# Altium project Robot Controller.PrjPCB
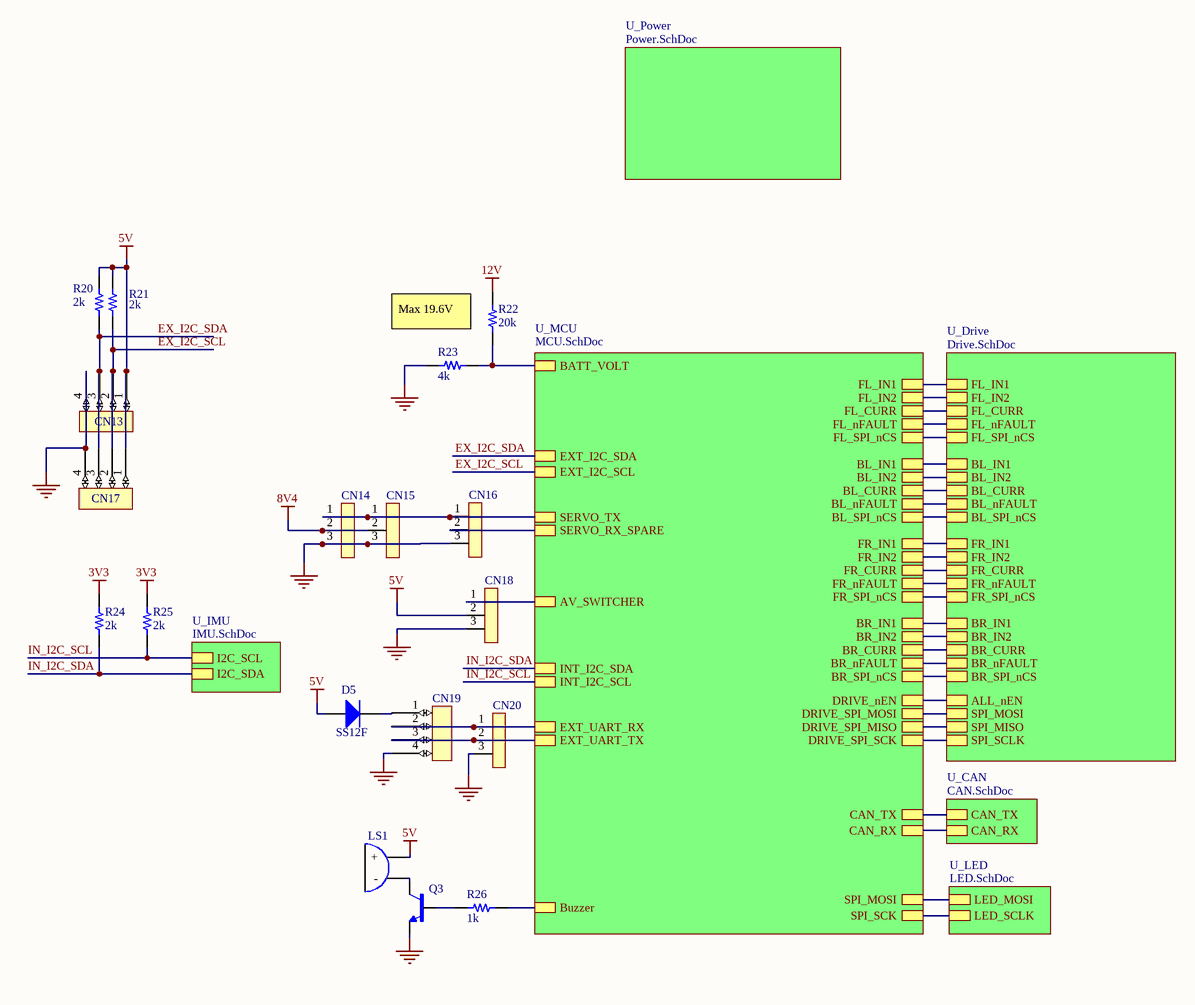
[diagram p0: Controller.SchDoc]
4 sheets, 90 parts. Net scope: hierarchical (ports join the sheet entries above them; power ports are global).
Board file: Controller.PcbDoc
Sheets:
  Controller.SchDoc
    U_MCU = MCU.SchDoc
    U_LED = LED.SchDoc
  DRV8843.SchDoc

## Sheet Controller.SchDoc
size A3

### Parts
CN13  JST_GH-4P  [JST_GH-4P]  (value not drawn)
CN14  3P-2.5mm  [2.5mm-3P]  (value not drawn)
CN15  3P-2.5mm  [2.5mm-3P]  (value not drawn)
CN16  3P-2.5mm  [2.5mm-3P]  (value not drawn)
CN17  JST_GH-4P  [JST_GH-4P]  (value not drawn)
CN18  3P-2.5mm  [2.5mm-3P]  (value not drawn)
CN19  JST_GH-4P  [JST_GH-4P]  (value not drawn)
CN20  3P-2.5mm  [2.5mm-3P]  (value not drawn)
D5  SS12F  [SMAF_DIODE]
LS1  Buzzer  [12-dia-buzzer]  (value not drawn)
Q3  S8050  [SOT23-FET]  (value not drawn)
R20  2k  [2010_SMD_Resistor]
R21  2k  [2010_SMD_Resistor]
R22  20k  [0805 - duplicate]
R23  4k  [0805 - duplicate]
R24  2k  [0805 - duplicate]
R25  2k  [0805 - duplicate]
R26  1k  [0805 - duplicate]

### Sub-sheets
U_CAN = CAN.SchDoc (file not in this document): CAN_TX, CAN_RX
U_Drive = Drive.SchDoc (file not in this document): FL_IN1, FL_IN2, ALL_nEN, BL_IN1, BL_IN2, FR_IN1, FR_IN2, BR_IN1, BR_IN2, FL_nFAULT, BL_nFAULT, BR_nFAULT, FR_nFAULT, FL_SPI_nCS, BL_SPI_nCS, BR_SPI_nCS, FR_SPI_nCS, SPI_MOSI, SPI_MISO, SPI_SCLK, BL_CURR, BR_CURR, FL_CURR, FR_CURR
U_IMU = IMU.SchDoc (file not in this document): I2C_SCL, I2C_SDA
U_LED = LED.SchDoc: LED_MOSI, LED_SCLK
U_MCU = MCU.SchDoc: BR_SPI_nCS, FR_SPI_nCS, BL_SPI_nCS, FL_SPI_nCS, FL_nFAULT, BL_nFAULT, FR_nFAULT, BR_nFAULT, BL_IN2, DRIVE_nEN, DRIVE_SPI_SCK, DRIVE_SPI_MISO, FR_IN2, SERVO_TX, SERVO_RX_SPARE, BL_CURR, FL_CURR, BATT_VOLT, BR_CURR, FR_CURR, FL_IN1, FL_IN2, BL_IN1, SPI_MOSI, SPI_SCK, FR_IN1, BR_IN1, BR_IN2, EXT_I2C_SCL, EXT_I2C_SDA, CAN_TX, CAN_RX, INT_I2C_SDA, INT_I2C_SCL, DRIVE_SPI_MOSI, EXT_UART_RX, EXT_UART_TX, AV_SWITCHER, Buzzer
U_Power = Power.SchDoc (file not in this document): no entries

### Nets
3V3: R24.2 R25.2
5V: CN13.1 CN17.1 CN18.2 D5.1(A) LS1.A(+) R20.2 R21.2
8V4: CN14.2 CN15.2
12V: R22.2
GND: CN13.4 CN14.3 CN15.3 CN16.3 CN17.4 CN18.3 CN19.4 CN20.3 Q3.2(E) R23.2
EX_I2C_SCL: CN13.2 CN17.2 R21.1 ; sheet U_MCU/EXT_I2C_SCL
EX_I2C_SDA: CN13.3 CN17.3 R20.1 ; sheet U_MCU/EXT_I2C_SDA
IN_I2C_SCL: R25.1 ; sheet U_IMU/I2C_SCL, sheet U_MCU/INT_I2C_SCL
IN_I2C_SDA: R24.1 ; sheet U_IMU/I2C_SDA, sheet U_MCU/INT_I2C_SDA
SWO: CN19.3 CN20.2 ; sheet U_MCU/EXT_UART_TX
NetCN14_1: CN14.1 CN15.1 CN16.1 ; sheet U_MCU/SERVO_TX
NetCN16_2: CN16.2 ; sheet U_MCU/SERVO_RX_SPARE
NetCN18_1: CN18.1 ; sheet U_MCU/AV_SWITCHER
NetCN19_1: CN19.1 D5.2(K)
NetCN19_2: CN19.2 CN20.1 ; sheet U_MCU/EXT_UART_RX
NetLS1_K: LS1.K(-) Q3.3(C)
NetQ3_1: Q3.1(B) R26.1
NetR22_1: R22.1 R23.1 ; sheet U_MCU/BATT_VOLT
NetR26_2: R26.2 ; sheet U_MCU/Buzzer
NetU3_2: sheet U_MCU/BR_SPI_nCS, sheet U_Drive/BR_SPI_nCS
NetU3_3: sheet U_MCU/FR_SPI_nCS, sheet U_Drive/FR_SPI_nCS
NetU3_4: sheet U_MCU/BL_SPI_nCS, sheet U_Drive/BL_SPI_nCS
NetU3_6: sheet U_MCU/FL_SPI_nCS, sheet U_Drive/FL_SPI_nCS
NetU3_8: sheet U_MCU/FL_nFAULT, sheet U_Drive/FL_nFAULT
NetU3_9: sheet U_MCU/BL_nFAULT, sheet U_Drive/BL_nFAULT
NetU3_10: sheet U_MCU/FR_nFAULT, sheet U_Drive/FR_nFAULT
NetU3_11: sheet U_MCU/BR_nFAULT, sheet U_Drive/BR_nFAULT
NetU3_14: sheet U_MCU/FL_IN1, sheet U_Drive/FL_IN1
NetU3_15: sheet U_MCU/FL_IN2, sheet U_Drive/FL_IN2
NetU3_16: sheet U_MCU/BL_IN1, sheet U_Drive/BL_IN1
NetU3_18: sheet U_MCU/BL_IN2, sheet U_Drive/BL_IN2
NetU3_20: sheet U_MCU/DRIVE_nEN, sheet U_Drive/ALL_nEN
NetU3_21: sheet U_MCU/DRIVE_SPI_SCK, sheet U_Drive/SPI_SCLK
NetU3_22: sheet U_MCU/DRIVE_SPI_MISO, sheet U_Drive/SPI_MISO
NetU3_23: sheet U_MCU/FR_IN2, sheet U_Drive/FR_IN2
NetU3_26: sheet U_MCU/BL_CURR, sheet U_Drive/BL_CURR
NetU3_27: sheet U_MCU/FL_CURR, sheet U_Drive/FL_CURR
NetU3_29: sheet U_MCU/BR_CURR, sheet U_Drive/BR_CURR
NetU3_30: sheet U_MCU/FR_CURR, sheet U_Drive/FR_CURR
NetU3_35: sheet U_MCU/SPI_MOSI, sheet U_LED/LED_MOSI
NetU3_36: sheet U_MCU/SPI_SCK, sheet U_LED/LED_SCLK
NetU3_37: sheet U_MCU/FR_IN1, sheet U_Drive/FR_IN1
NetU3_39: sheet U_MCU/BR_IN1, sheet U_Drive/BR_IN1
NetU3_40: sheet U_MCU/BR_IN2, sheet U_Drive/BR_IN2
NetU3_57: sheet U_MCU/DRIVE_SPI_MOSI, sheet U_Drive/SPI_MOSI
NetU3_61: sheet U_MCU/CAN_RX, sheet U_CAN/CAN_RX
NetU3_62: sheet U_MCU/CAN_TX, sheet U_CAN/CAN_TX

### Notes on the sheet
- (near R22) Max 19.6V

### Library data of the parts
Q3 = S8050: MF: MICROSS/On Semiconductor; MP: 2N2222; Value: *; Package: TO-18-3 NJS; Digi-Key_Purchase_URL: https://www.digikey.com.mx/product-detail/en/microsemi-corporation/JANS2N2222A/1086-15156-ND/4384334?utm_source=snapeda&utm_medium=aggregator&utm_campaign=symbol; SnapEDA_Link: https://www.snapeda.com/parts/2N2222/MICROSS/On%20Semiconductor/view-part/561967/?ref=snap; Digi-Key_Part_Number: 1086-15156-ND
R20-R26 = Resistor

## Sheet MCU.SchDoc
size A3
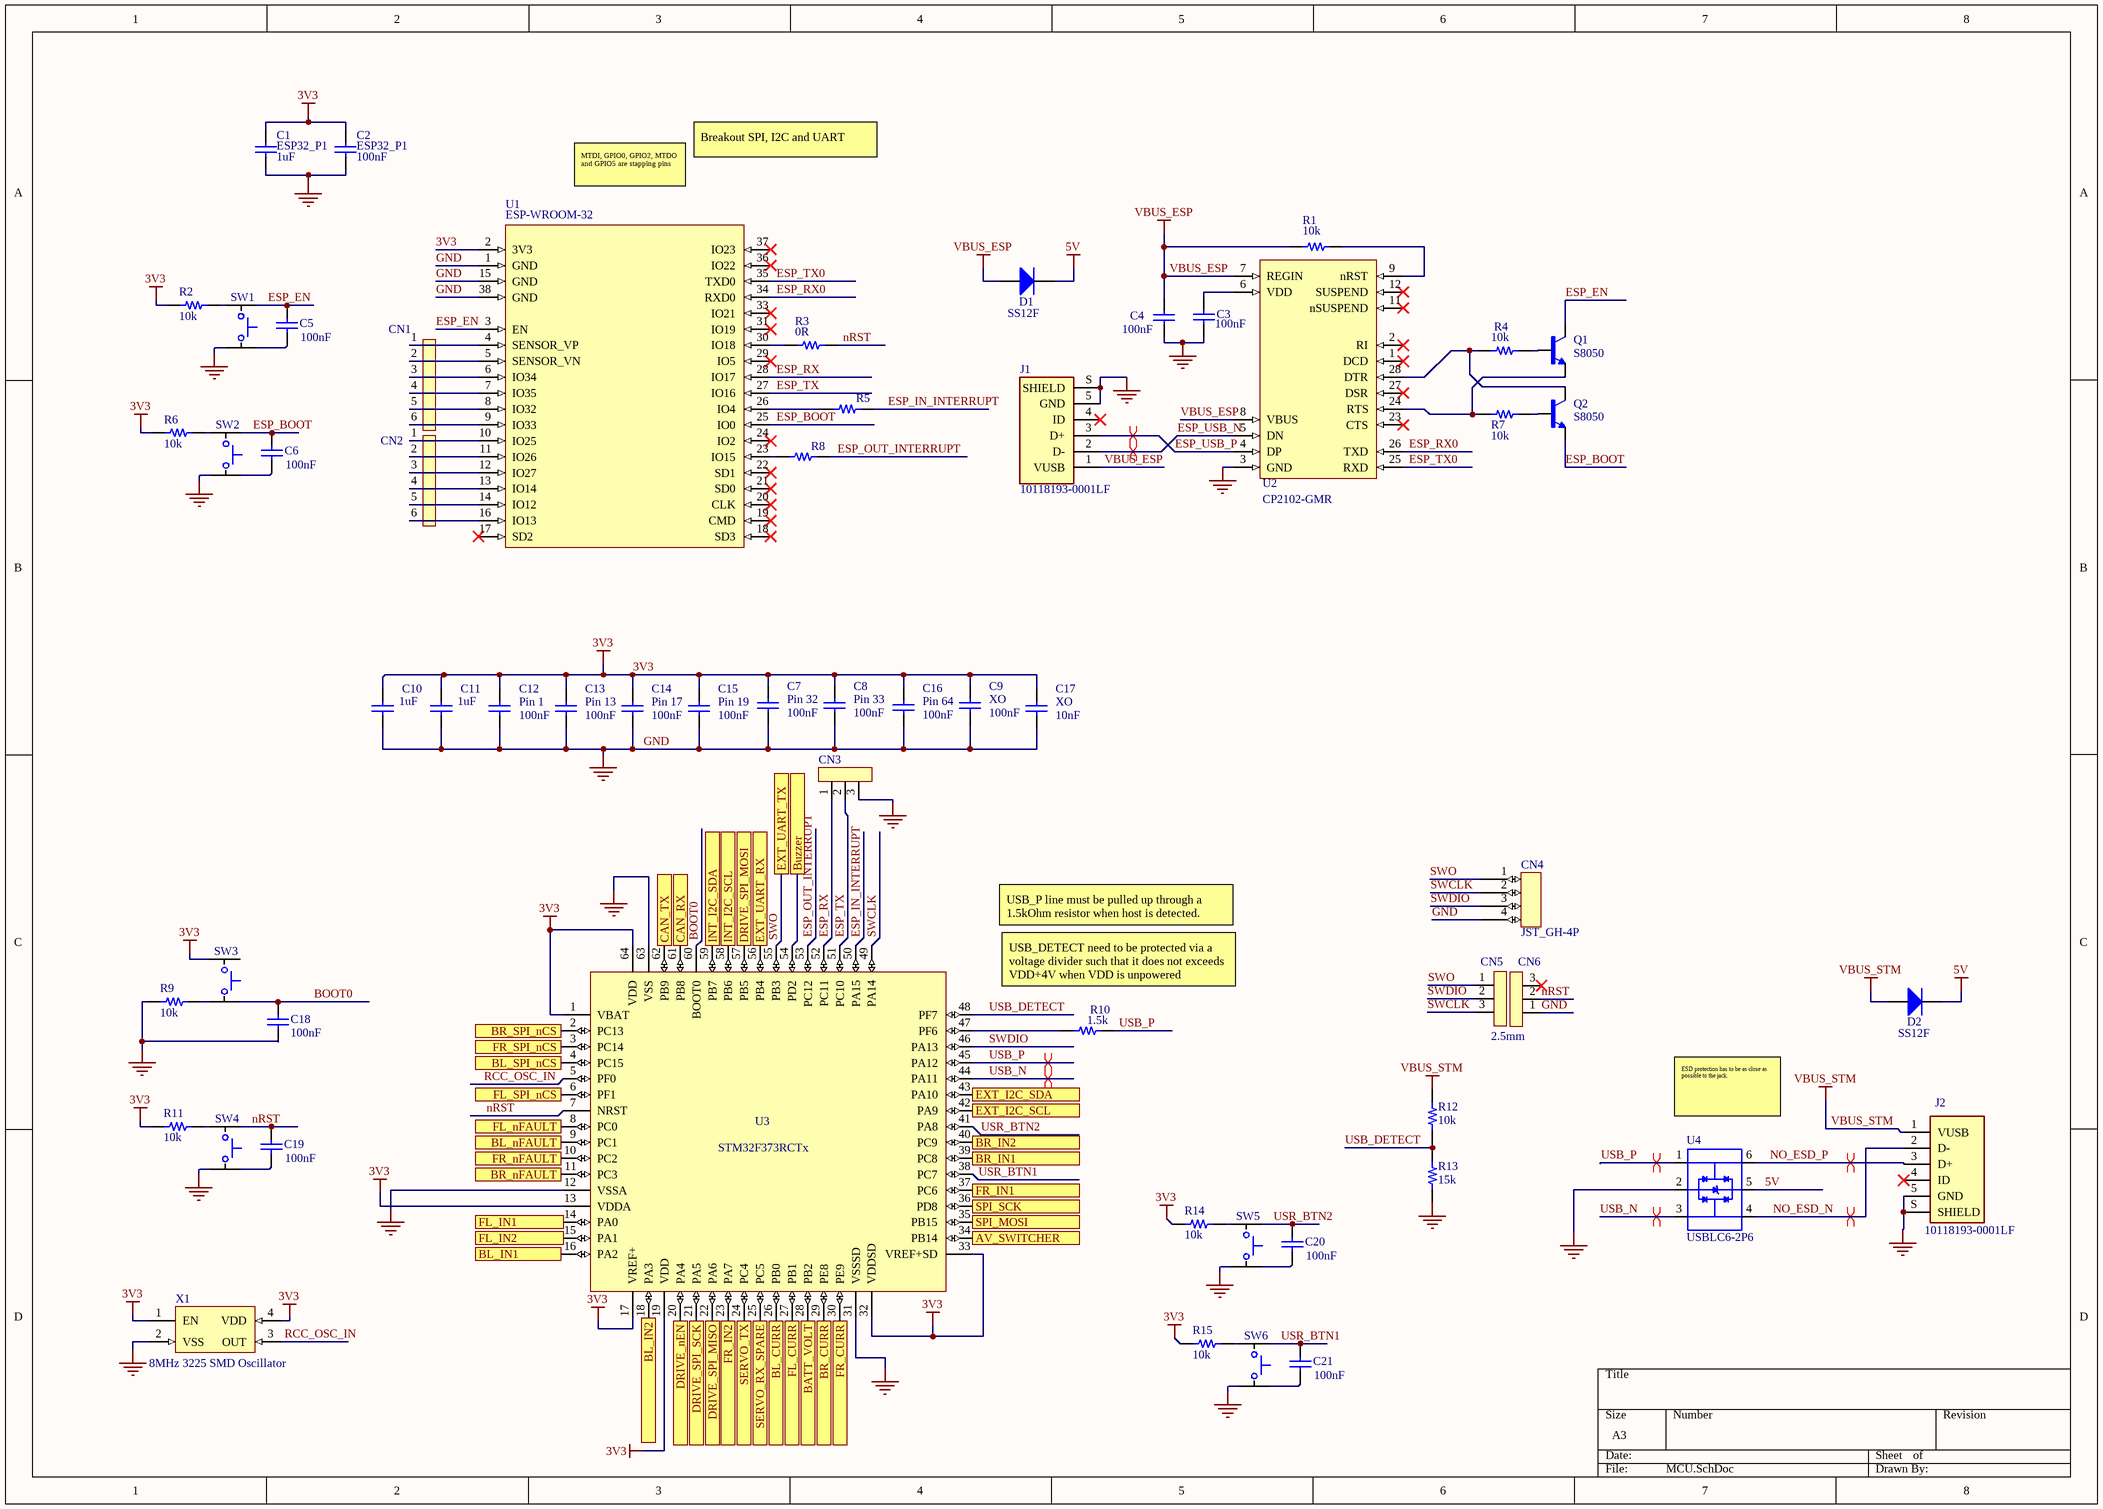
[diagram p1: MCU.SchDoc]

### Parts
C1  ESP32_P1  value 1uF  [0402]
C2  ESP32_P1  value 100nF  [0402]
C3  value 100nF  [0402]  (hidden comment: P6)
C4  value 100nF  [0402]  (hidden comment: P7)
C5  value 100nF  [0402]  (hidden comment: Cap)
C6  value 100nF  [0402]  (hidden comment: Cap)
C7  Pin 32  value 100nF  [0402]
C8  Pin 33  value 100nF  [0402]
C9  XO  value 100nF  [0402]
C10  value 1uF  [0402]
C11  value 1uF  [0402]
C12  Pin 1  value 100nF  [0402]
C13  Pin 13  value 100nF  [0402]
C14  Pin 17  value 100nF  [0402]
C15  Pin 19  value 100nF  [0402]
C16  Pin 64  value 100nF  [0402]
C17  XO  value 10nF  [0402]
C18  value 100nF  [0402]  (hidden comment: Cap)
C19  value 100nF  [0402]  (hidden comment: Cap)
C20  value 100nF  [0402]  (hidden comment: Cap)
C21  value 100nF  [0402]  (hidden comment: Cap)
CN1  6P-2.5mm  [6-Pin-Header]  (value not drawn)
CN2  6P-2.5mm  [6-Pin-Header]  (value not drawn)
CN3  3P-2.5mm  [2.5mm-3P]  (value not drawn)
CN4  JST_GH-4P  [JST_GH-4P]
CN5  2.5mm  [2.5mm-3P]
CN6  3P-2.5mm  [2.5mm-3P]  (value not drawn)
D1  SS12F  [SMAF_DIODE]
D2  SS12F  [SMAF_DIODE]
J1  10118193-0001LF  [FCI_10118193-0001LF]
J2  10118193-0001LF  [FCI_10118193-0001LF]
Q1  S8050  [SOT23-FET]
Q2  S8050  [SOT23-FET]
R1  10k  [0805 - duplicate]
R2  10k  [0805 - duplicate]
R3  0R  [0805 - duplicate]
R4  10k  [0805 - duplicate]
R5  1k  [0805 - duplicate]  (value not drawn)
R6  10k  [0805 - duplicate]
R7  10k  [0805 - duplicate]
R8  1k  [0805 - duplicate]  (value not drawn)
R9  10k  [0805 - duplicate]
R10  1.5k  [0805 - duplicate]
R11  10k  [0805 - duplicate]
R12  10k  [2010_SMD_Resistor]
R13  15k  [2010_SMD_Resistor]
R14  10k  [0805 - duplicate]
R15  10k  [0805 - duplicate]
SW1  SPST Switch  [4.8x4.8-SMD-SWITCH]  (value not drawn)
SW2  SPST Switch  [4.8x4.8-SMD-SWITCH]  (value not drawn)
SW3  SPST Switch  [4.8x4.8-SMD-SWITCH]  (value not drawn)
SW4  SPST Switch  [4.8x4.8-SMD-SWITCH]  (value not drawn)
SW5  USR_BTN2  [4.8x4.8-SMD-SWITCH]  (value not drawn)
SW6  USR_BTN1  [4.8x4.8-SMD-SWITCH]  (value not drawn)
U1  ESP-WROOM-32  [ESP-WROOM-32]
U2  CP2102-GMR  [QFN28G_0.5-5X5MM]
U3  STM32F373RCTx  [LQFP64]
U4  USBLC6-2P6  [SOT50P160X60-6N]
X1  8MHz 3225 SMD Oscillator  [3.2x2.5 SMD]

### Ports
AV_SWITCHER, BATT_VOLT, BL_CURR, BL_IN1, BL_IN2, BL_nFAULT, BL_SPI_nCS, BR_CURR, BR_IN1, BR_IN2, BR_nFAULT, BR_SPI_nCS, Buzzer, CAN_RX, CAN_TX, DRIVE_nEN, DRIVE_SPI_MISO, DRIVE_SPI_MOSI, DRIVE_SPI_SCK, EXT_I2C_SCL, EXT_I2C_SDA, EXT_UART_RX, EXT_UART_TX, FL_CURR, FL_IN1, FL_IN2, FL_nFAULT, FL_SPI_nCS, FR_CURR, FR_IN1, FR_IN2, FR_nFAULT, FR_SPI_nCS, INT_I2C_SCL, INT_I2C_SDA, SERVO_RX_SPARE, SERVO_TX, SPI_MOSI, SPI_SCK

### Nets
3V3: C1.2 C2.2 C7.2 C8.2 C9.2 C10.2 C11.2 C12.2 C13.2 C14.2 C15.2 C16.2 C17.2 R2.1 R6.1 R11.1 R14.1 R15.1 SW3.1 U1.2(3V3) U3.1(VBAT) U3.13(VDDA) U3.17(VREF+) U3.19(VDD) U3.32(VDDSD) U3.33(VREF+SD) U3.64(VDD) X1.1(EN) X1.4(VDD)
5V: D1.2(K) D2.2(K) U4.5(VBUS)
GND: C1.1 C2.1 C3.1 C4.1 C7.1 C8.1 C9.1 C10.1 C11.1 C12.1 C13.1 C14.1 C15.1 C16.1 C17.1 C18.2 CN3.3 CN4.4 CN6.1 J1.5(GND) J1.S(SHIELD) J2.5(GND) J2.S(SHIELD) R9.1 R13.1 SW1.3 SW2.3 SW4.3 SW5.3 SW6.3 U1.1(GND) U1.15(GND) U1.38(GND) U2.3(GND) U3.12(VSSA) U3.31(VSSSD) U3.63(VSS) U4.2(GND) X1.2(VSS)
VBUS_ESP: C4.2 D1.1(A) J1.1(VUSB) R1.1 U2.7(REGIN) U2.8(VBUS)
VBUS_STM: D2.1(A) J2.1(VUSB) R12.2
BOOT0: C18.1 SW3.4 U3.60(BOOT0)
ESP_BOOT: C6.2 Q2.2(E) SW2.2 U1.25(IO0)
ESP_EN: C5.2 Q1.3(C) SW1.2 U1.3(EN)
ESP_IN_INTERRUPT: R5.2 U3.50(PA15)
ESP_OUT_INTERRUPT: R8.2 U3.53(PC12)
ESP_RX: CN3.1 U1.28(IO17) U3.52(PC11)
ESP_RX0: U1.34(RXD0) U2.26(TXD)
ESP_TX: CN3.2 U1.27(IO16) U3.51(PC10)
ESP_TX0: U1.35(TXD0) U2.25(RXD)
ESP_USB_N: J1.2(D-) U2.5(DN)
ESP_USB_P: J1.3(D+) U2.4(DP)
EX_I2C_SCL: U3.42(PA9) ; port EXT_I2C_SCL
EX_I2C_SDA: U3.43(PA10) ; port EXT_I2C_SDA
IN_I2C_SCL: U3.58(PB6) ; port INT_I2C_SCL
IN_I2C_SDA: U3.59(PB7) ; port INT_I2C_SDA
NO_ESD_N: J2.2(D-) U4.4(I/O2_2)
NO_ESD_P: J2.3(D+) U4.6(I/O1_2)
nRST: C19.2 CN6.2 R3.2 SW4.2 U3.7(NRST)
RCC_OSC_IN: U3.5(PF0) X1.3(OUT)
SWCLK: CN4.2 CN5.3 U3.49(PA14)
SWDIO: CN4.3 CN5.2 U3.46(PA13)
SWO: CN4.1 CN5.1 U3.55(PB3) ; port EXT_UART_TX
USB_DETECT: R12.1 R13.2 U3.48(PF7)
USB_N: U3.44(PA11) U4.3(I/O2_1)
USB_P: R10.2 U3.45(PA12) U4.1(I/O1_1)
USR_BTN1: C21.2 SW6.2 U3.38(PC7)
USR_BTN2: C20.2 SW5.2 U3.41(PA8)
NetC3_2: C3.2 U2.6(VDD)
NetC5_1: C5.1 SW1.4
NetC6_1: C6.1 SW2.4
NetC19_1: C19.1 SW4.4
NetC20_1: C20.1 SW5.4
NetC21_1: C21.1 SW6.4
NetCN1_1: CN1.1 U1.4(SENSOR_VP)
NetCN1_2: CN1.2 U1.5(SENSOR_VN)
NetCN1_3: CN1.3 U1.6(IO34)
NetCN1_4: CN1.4 U1.7(IO35)
NetCN1_5: CN1.5 U1.8(IO32)
NetCN1_6: CN1.6 U1.9(IO33)
NetCN2_1: CN2.1 U1.10(IO25)
NetCN2_2: CN2.2 U1.11(IO26)
NetCN2_3: CN2.3 U1.12(IO27)
NetCN2_4: CN2.4 U1.13(IO14)
NetCN2_5: CN2.5 U1.14(IO12)
NetCN2_6: CN2.6 U1.16(IO13)
NetCN14_1: U3.24(PC4) ; port SERVO_TX
NetCN16_2: U3.25(PC5) ; port SERVO_RX_SPARE
NetCN18_1: U3.34(PB14) ; port AV_SWITCHER
NetCN19_2: U3.56(PB4) ; port EXT_UART_RX
NetQ1_1: Q1.1(B) R4.2
NetQ1_2: Q1.2(E) R7.1 U2.24(RTS)
NetQ2_1: Q2.1(B) R7.2
NetQ2_3: Q2.3(C) R4.1 U2.28(DTR)
NetR1_2: R1.2 U2.9(nRST)
NetR2_2: R2.2 SW1.1
NetR3_1: R3.1 U1.30(IO18)
NetR5_1: R5.1 U1.26(IO4)
NetR6_2: R6.2 SW2.1
NetR8_1: R8.1 U1.23(IO15)
NetR9_2: R9.2 SW3.3
NetR10_1: R10.1 U3.47(PF6)
NetR11_2: R11.2 SW4.1
NetR14_2: R14.2 SW5.1
NetR15_2: R15.2 SW6.1
NetR22_1: U3.28(PB2) ; port BATT_VOLT
NetR26_2: U3.54(PD2) ; port Buzzer
NetU3_2: U3.2(PC13) ; port BR_SPI_nCS
NetU3_3: U3.3(PC14) ; port FR_SPI_nCS
NetU3_4: U3.4(PC15) ; port BL_SPI_nCS
NetU3_6: U3.6(PF1) ; port FL_SPI_nCS
NetU3_8: U3.8(PC0) ; port FL_nFAULT
NetU3_9: U3.9(PC1) ; port BL_nFAULT
NetU3_10: U3.10(PC2) ; port FR_nFAULT
NetU3_11: U3.11(PC3) ; port BR_nFAULT
NetU3_14: U3.14(PA0) ; port FL_IN1
NetU3_15: U3.15(PA1) ; port FL_IN2
NetU3_16: U3.16(PA2) ; port BL_IN1
NetU3_18: U3.18(PA3) ; port BL_IN2
NetU3_20: U3.20(PA4) ; port DRIVE_nEN
NetU3_21: U3.21(PA5) ; port DRIVE_SPI_SCK
NetU3_22: U3.22(PA6) ; port DRIVE_SPI_MISO
NetU3_23: U3.23(PA7) ; port FR_IN2
NetU3_26: U3.26(PB0) ; port BL_CURR
NetU3_27: U3.27(PB1) ; port FL_CURR
NetU3_29: U3.29(PE8) ; port BR_CURR
NetU3_30: U3.30(PE9) ; port FR_CURR
NetU3_35: U3.35(PB15) ; port SPI_MOSI
NetU3_36: U3.36(PD8) ; port SPI_SCK
NetU3_37: U3.37(PC6) ; port FR_IN1
NetU3_39: U3.39(PC8) ; port BR_IN1
NetU3_40: U3.40(PC9) ; port BR_IN2
NetU3_57: U3.57(PB5) ; port DRIVE_SPI_MOSI
NetU3_61: U3.61(PB8) ; port CAN_RX
NetU3_62: U3.62(PB9) ; port CAN_TX

Not connected (* = marked no-connect by the designer): CN6 3*; J1 4(ID)*; J2 4(ID)*; SW3 2; U1 17(SD2)* 18(SD3)* 19(CMD)* 20(CLK)* 21(SD0)* 22(SD1)* 24(IO2)* 29(IO5)* 31(IO19)* 33(IO21)* 36(IO22)* 37(IO23)*; U2 1(DCD)* 2(RI)* 11(nSUSPEND)* 12(SUSPEND)* 23(CTS)* 27(DSR)*

### Layout directives
differential pair: ESP_USB_N, ESP_USB_P, NO_ESD_N, NO_ESD_P, USB_N, USB_P

### Notes on the sheet
- MTDI, GPIO0, GPIO2, MTDO and GPIO5 are stapping pins
- Breakout SPI, I2C and UART
- USB_P line must be pulled up through a 1.5kOhm resistor when host is detected.
- USB_DETECT need to be protected via a voltage divider such that it does not exceeds VDD+4V when VDD is unpowered
- (near U4) ESD protection has to be as close as possible to the jack.

### Library data of the parts
C1-C4 C7-C17 = Cap: Published: 8-Jun-2000; LatestRevisionDate: 17-Jul-2002; LatestRevisionNote: Re-released for DXP Platform.; PackageReference: RAD-0.3; Publisher: Altium Limited; PackageDescription: Radial Cap, Thru-Hole; 2 Leads; 0.3 in Pin Spacing
CN5 = 3P-2.5mm
J1 J2 = 10118193-0001LF: USB - micro B USB 2.0 Receptacle Connector 5 Position Surface Mount, Right Angle; Through Hole; MF: Amphenol ICC; Availability: Unavailable; SnapEDA_Link: https://www.snapeda.com/parts/10118193-0001LF/Amphenol%20FCI/view-part/2758989/?ref=snap; MP: 10118193-0001LF; Price: None; Value: *; Package: None
Q1 Q2 = S8050: MF: MICROSS/On Semiconductor; MP: 2N2222; Value: *; Package: TO-18-3 NJS; Digi-Key_Purchase_URL: https://www.digikey.com.mx/product-detail/en/microsemi-corporation/JANS2N2222A/1086-15156-ND/4384334?utm_source=snapeda&utm_medium=aggregator&utm_campaign=symbol; SnapEDA_Link: https://www.snapeda.com/parts/2N2222/MICROSS/On%20Semiconductor/view-part/561967/?ref=snap; Digi-Key_Part_Number: 1086-15156-ND
R1-R15 = Resistor
SW5 SW6 = SPST Switch
U1 = ESP-WROOM-32: WiFi 802.11b/g/n/d/e/i Transceiver Module 2.4GHz Surface Mount; MF: Olimex LTD; SnapEDA_Link: https://www.snapeda.com/parts/ESP-WROOM-32/Olimex%20LTD/view-part/2311927/?ref=snap; Package: Module Olimex LTD; MP: ESP-WROOM-32; Availability: Unavailable; Price: None; Value: *
U4 = USBLC6-2P6: 17V Clamp 5A _8/20µs_ Ipp Tvs Diode Surface Mount SOT-666; MF: STMicroelectronics; Value: *; MP: USBLC6-2P6; SnapEDA_Link: https://www.snapeda.com/parts/USBLC6-2P6/STMicroelectronics/view-part/106846/?ref=snap; Availability: Unavailable; Price: None; Package: SOT-563 STMicroelectronics
C5 C6 C18-C21 = Cap: Published: 8-Jun-2000; LatestRevisionDate: 17-Jul-2002; LatestRevisionNote: Re-released for DXP Platform.; PackageReference: RAD-0.3; Publisher: Altium Limited; PackageDescription: Radial Cap, Thru-Hole; 2 Leads; 0.3 in Pin Spacing

## Sheet LED.SchDoc
size A3
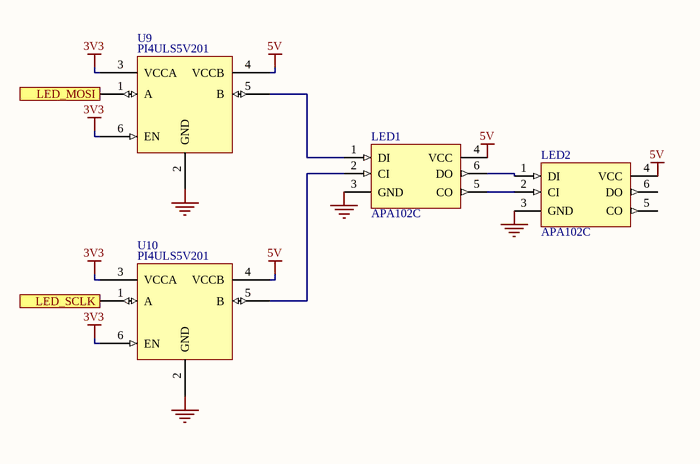
[diagram p2: LED.SchDoc]

### Parts
LED1  APA102C  [5x5_WS2812]
LED2  APA102C  [5x5_WS2812]
U9  PI4ULS5V201  [SOT23-PI4ULS5V201]
U10  PI4ULS5V201  [SOT23-PI4ULS5V201]

### Ports
LED_MOSI, LED_SCLK

### Nets
3V3: U9.3(VCCA) U9.6(EN) U10.3(VCCA) U10.6(EN)
5V: LED1.4(VCC) LED2.4(VCC) U9.4(VCCB) U10.4(VCCB)
GND: LED1.3(GND) LED2.3(GND) U9.2(GND) U10.2(GND)
NetLED1_1: LED1.1(DI) U9.5(B)
NetLED1_2: LED1.2(CI) U10.5(B)
NetLED1_5: LED1.5(CO) LED2.2(CI)
NetLED1_6: LED1.6(DO) LED2.1(DI)
NetU3_35: U9.1(A) ; port LED_MOSI
NetU3_36: U10.1(A) ; port LED_SCLK

Not connected (* = marked no-connect by the designer): LED2 5(CO) 6(DO)

### Library data of the parts
U9 U10 = PI4ULS5V201: Level Translator

## Sheet DRV8843.SchDoc
size A3
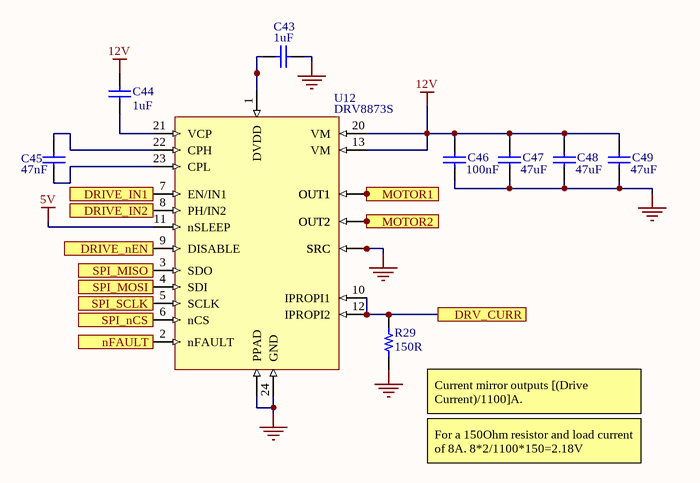
[diagram p3: DRV8843.SchDoc]

### Parts
C43  value 1uF  [0402]  (hidden comment: Cap)
C44  value 1uF  [0402]  (hidden comment: Cap)
C45  value 47nF  [0402]  (hidden comment: Cap)
C46  value 100nF  [0402]  (hidden comment: Cap)
C47  value 47uF  [1206]  (hidden comment: Cap)
C48  value 47uF  [1206]  (hidden comment: Cap)
C49  value 47uF  [1206]  (hidden comment: Cap)
R29  150R  [0805 - duplicate]
U12  DRV8873S  [HTSSOP24]

### Ports
DRIVE_IN1, DRIVE_IN2, DRIVE_nEN, DRV_CURR, MOTOR1, MOTOR2, nFAULT, SPI_MISO, SPI_MOSI, SPI_nCS, SPI_SCLK

### Nets
5V: U12.11(nSLEEP)
12V: C44.2 C46.2 C47.2 C48.2 C49.2 U12.13(VM) U12.20(VM)
GND: C43.2 C46.1 C47.1 C48.1 C49.1 R29.1 U12.16(SRC) U12.17(SRC) U12.24(GND) U12.THERM(PPAD)
NetC43_1: C43.1 U12.1(DVDD)
NetC44_1: C44.1 U12.21(VCP)
NetC45_1: C45.1 U12.23(CPL)
NetC45_2: C45.2 U12.22(CPH)
NetR29_2: R29.2 U12.10(IPROPI1) U12.12(IPROPI2) ; port DRV_CURR
NetU12_2: U12.2(nFAULT) ; port nFAULT
NetU12_3: U12.3(SDO) ; port SPI_MISO
NetU12_4: U12.4(SDI) ; port SPI_MOSI
NetU12_5: U12.5(SCLK) ; port SPI_SCLK
NetU12_6: U12.6(nCS) ; port SPI_nCS
NetU12_7: U12.7(EN/IN1) ; port DRIVE_IN1
NetU12_8: U12.8(PH/IN2) ; port DRIVE_IN2
NetU12_9: U12.9(DISABLE) ; port DRIVE_nEN
NetU12_14: U12.14(OUT2) U12.15(OUT2) ; port MOTOR2
NetU12_18: U12.18(OUT1) U12.19(OUT1) ; port MOTOR1

### Notes on the sheet
- (near R29) Current mirror outputs [(Drive Current)/1100]A.
- For a 150Ohm resistor and load current of 8A. 8*2/1100*150=2.18V

### Library data of the parts
R29 = Resistor
C43-C49 = Cap: Published: 8-Jun-2000; LatestRevisionDate: 17-Jul-2002; LatestRevisionNote: Re-released for DXP Platform.; PackageReference: RAD-0.3; Publisher: Altium Limited; PackageDescription: Radial Cap, Thru-Hole; 2 Leads; 0.3 in Pin Spacing

## Nets that join several sheets
3V3: Controller (R24.2 R25.2), MCU (29 pins), LED (U9.3 U9.6 U10.3 U10.6)
5V: Controller (7 pins), MCU (D1.2 D2.2 U4.5), LED (LED1.4 LED2.4 U9.4 U10.4), DRV8843 (U12.11)
12V: Controller (R22.2), DRV8843 (7 pins)
GND: Controller (10 pins), MCU (39 pins), LED (LED1.3 LED2.3 U9.2 U10.2), DRV8843 (10 pins)
EX_I2C_SCL: Controller (CN13.2 CN17.2 R21.1), MCU (U3.42)
EX_I2C_SDA: Controller (CN13.3 CN17.3 R20.1), MCU (U3.43)
IN_I2C_SCL: Controller (R25.1), MCU (U3.58)
IN_I2C_SDA: Controller (R24.1), MCU (U3.59)
NetCN14_1: Controller (CN14.1 CN15.1 CN16.1), MCU (U3.24)
NetCN16_2: Controller (CN16.2), MCU (U3.25)
NetCN18_1: Controller (CN18.1), MCU (U3.34)
NetCN19_2: Controller (CN19.2 CN20.1), MCU (U3.56)
NetR22_1: Controller (R22.1 R23.1), MCU (U3.28)
NetR26_2: Controller (R26.2), MCU (U3.54)
NetU3_35: MCU (U3.35), LED (U9.1)
NetU3_36: MCU (U3.36), LED (U10.1)
SWO: Controller (CN19.3 CN20.2), MCU (CN4.1 CN5.1 U3.55)